# EasyEDA Pro project ECU_Project.epro, schematic Schematic1
Board Name: Embed Rev; Create Date: 2025-01-14; Page Name: P1; Project Name: ECU; Schematic Name: Schematic1; Update Date: 2025-02-04; Company: ProjectKita; Drawn: Yunus; Page Size: A2; Part Number: JLCPCB-002; Reviewed: EasyEDA; Version: V0.1
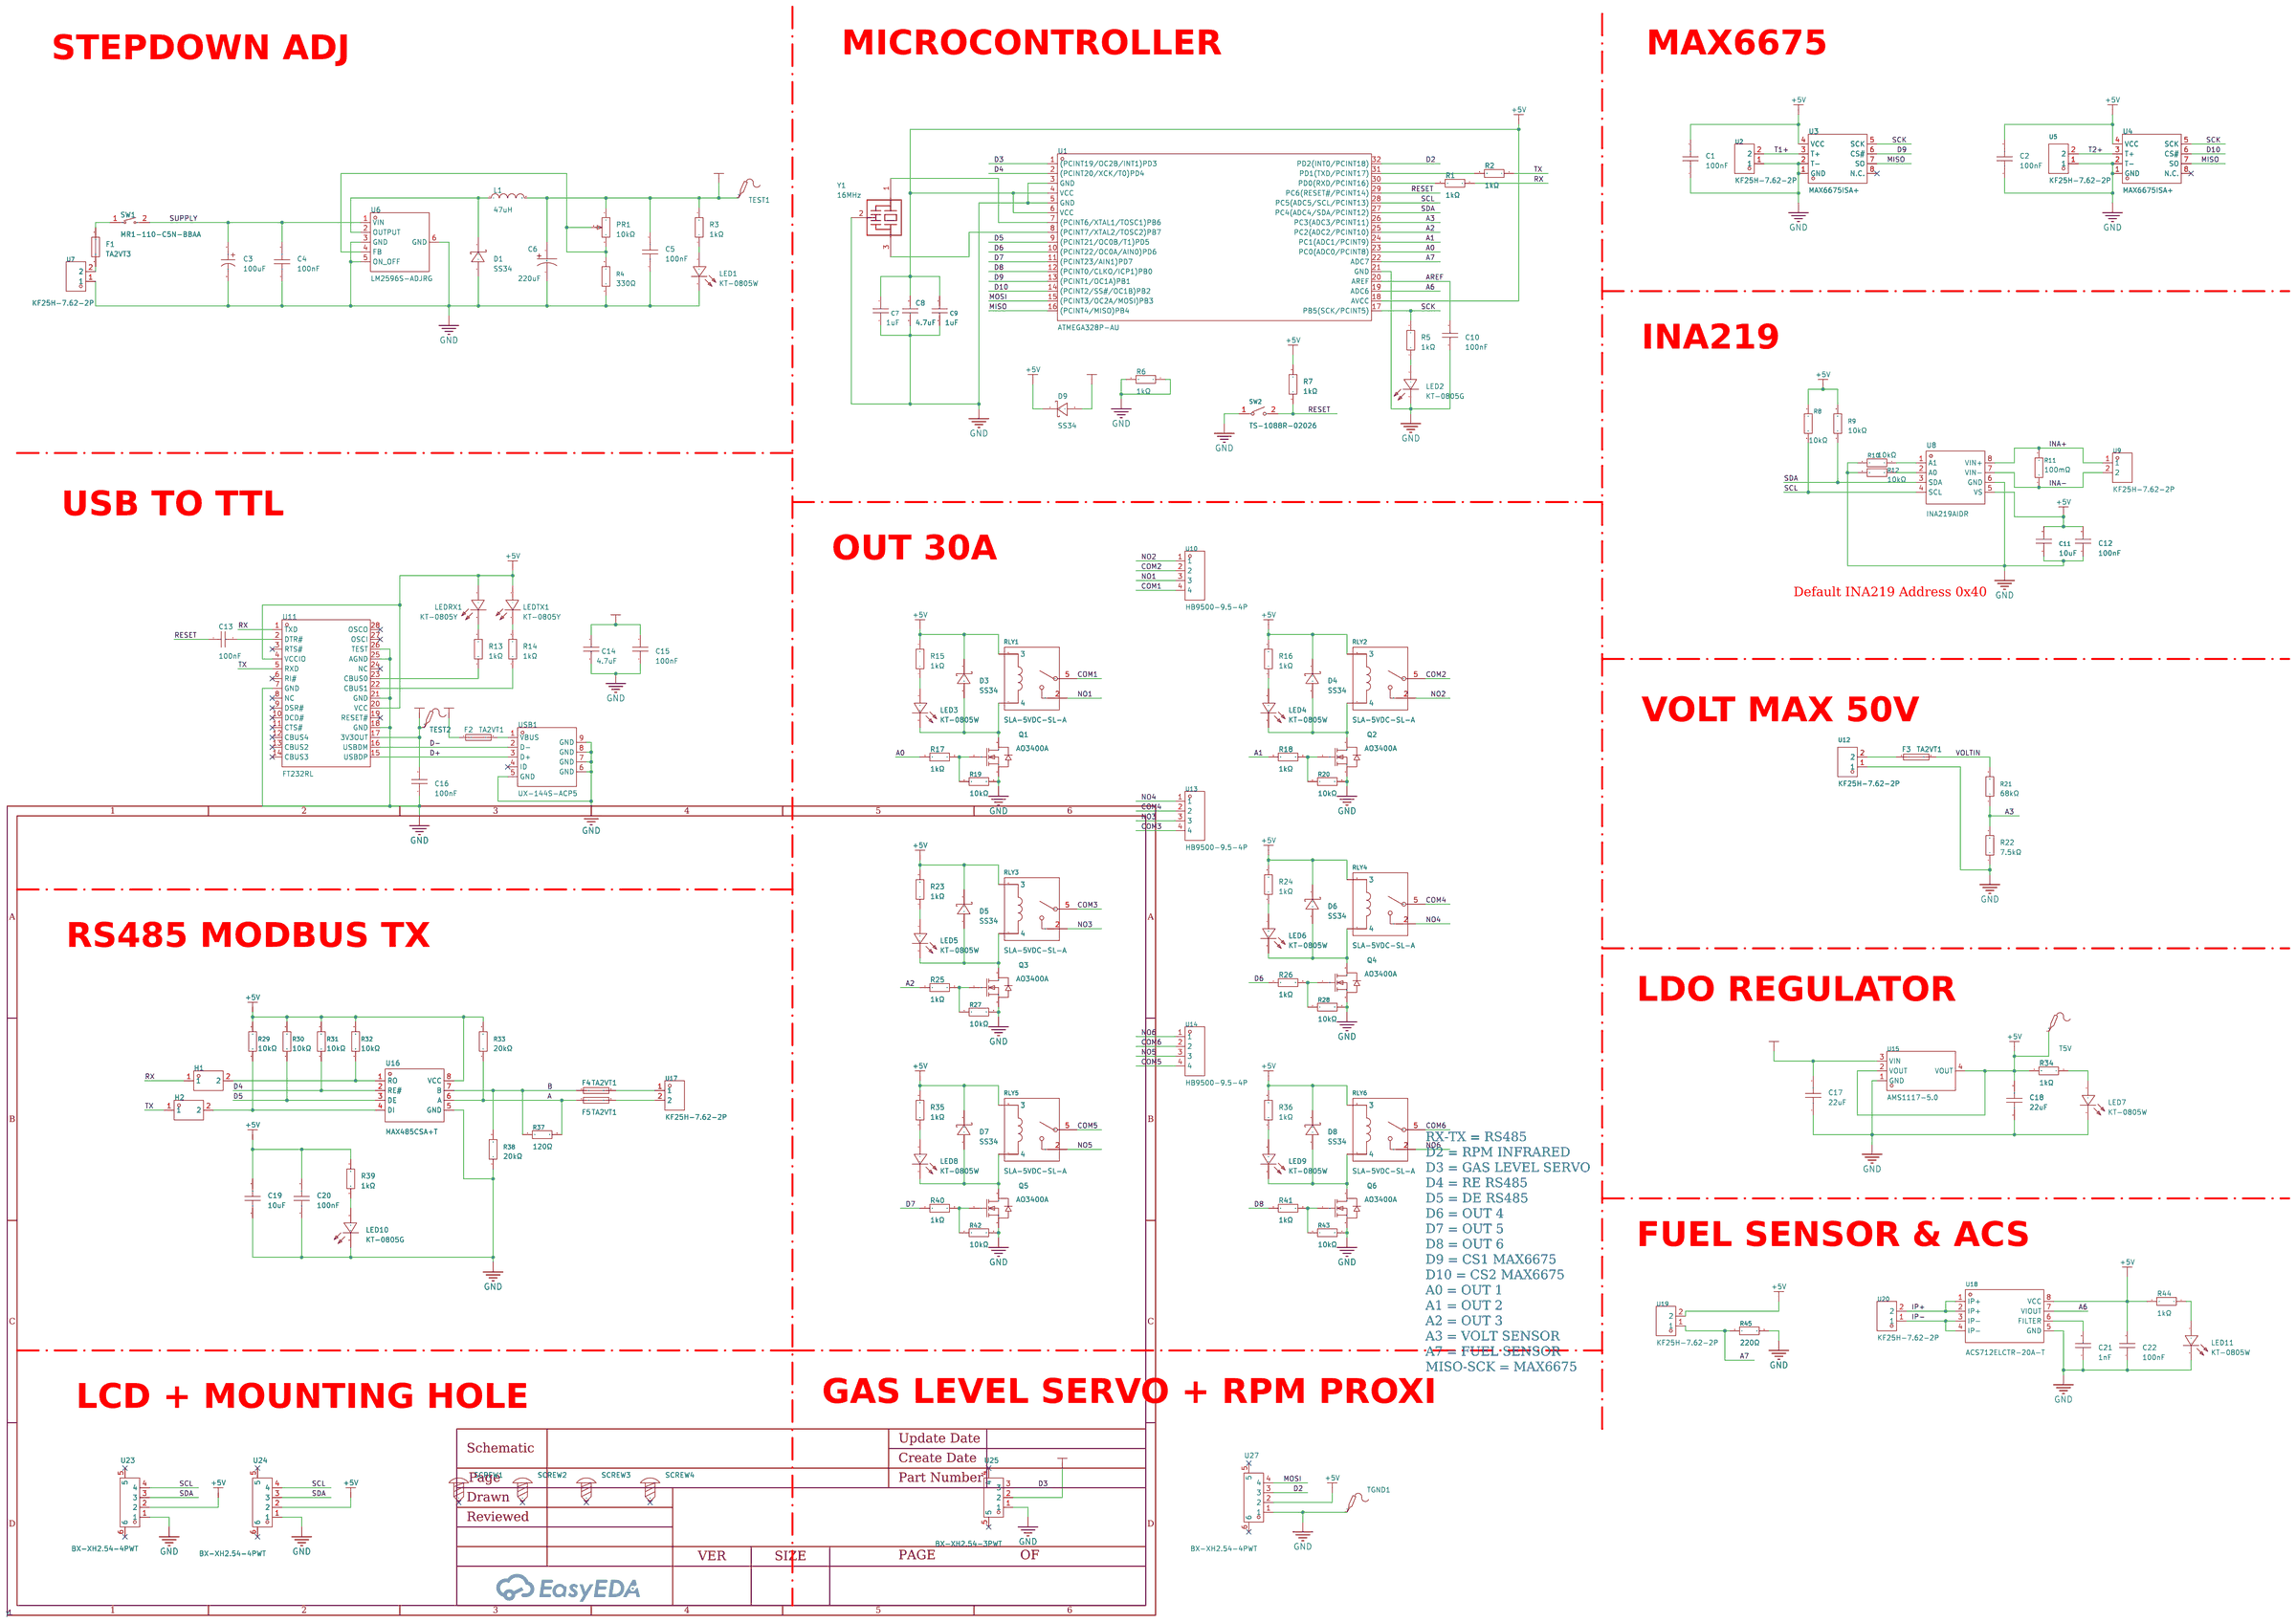
[diagram p1: schematic sheet]

## Parts
C1  100nF  [C0805]
C2  100nF  [C0805]
C3  100uF  [CAP-SMD_BD8.0-L8.3-W8.3-LS10.0-FD]
C4  100nF  [C0805]
C5  100nF  [C0805]
C6  220uF  [CAP-SMD_BD8.0-L8.3-W8.3-FD]
C7  1uF  [C0805]
C8  4.7uF  [C0805]
C9  1uF  [C0805]
C10  100nF  [C0805]
C11  10uF  [C0805]
C12  100nF  [C0805]
C13  100nF  [C0805]
C14  4.7uF  [C0805]
C15  100nF  [C0805]
C16  100nF  [C0805]
C17  22uF  [C0805]
C18  22uF  [C0805]
C19  10uF  [C0805]
C20  100nF  [C0805]
C21  1nF  [C0805]
C22  100nF  [C0805]
D1  SS34  [SMA_L4.3-W2.6-LS5.2-RD]
D3  SS34  [SMA_L4.3-W2.6-LS5.2-RD]
D4  SS34  [SMA_L4.3-W2.6-LS5.2-RD]
D5  SS34  [SMA_L4.3-W2.6-LS5.2-RD]
D6  SS34  [SMA_L4.3-W2.6-LS5.2-RD]
D7  SS34  [SMA_L4.3-W2.6-LS5.2-RD]
D8  SS34  [SMA_L4.3-W2.6-LS5.2-RD]
D9  SS34  [SMA_L4.3-W2.6-LS5.2-RD]
F1  TA2VT3  [FUSE-SMD_L6.1-W2.5]
F2  TA2VT1  [F2410]
F3  TA2VT1  [F2410]
F4  TA2VT1  [F2410]
F5  TA2VT1  [F2410]
H1  -  [HDR-TH_2P-P2.54-V-M-2]
H2  -  [HDR-TH_2P-P2.54-V-M-2]
L1  47uH  [IND-SMD_L12.0-W12.0_CDRH127NP]
LED1  KT-0805W  [LED0805-R-RD]
LED2  KT-0805G  [LED0805-R-RD]
LED3  KT-0805W  [LED0805-R-RD]
LED4  KT-0805W  [LED0805-R-RD]
LED5  KT-0805W  [LED0805-R-RD]
LED6  KT-0805W  [LED0805-R-RD]
LED7  KT-0805W  [LED0805-R-RD]
LED8  KT-0805W  [LED0805-R-RD]
LED9  KT-0805W  [LED0805-R-RD]
LED10  KT-0805G  [LED0805-R-RD]
LED11  KT-0805W  [LED0805-R-RD]
LEDRX1  KT-0805Y  [LED0805-R-RD]
LEDTX1  KT-0805Y  [LED0805-R-RD]
PR1  10kΩ  [RES-ADJ-TH_3P-L10.0-W10.0-P2.50-L]
Q1  AO3400A  [SOT-23-3_L2.9-W1.3-P1.90-LS2.4-BR]
Q2  AO3400A  [SOT-23-3_L2.9-W1.3-P1.90-LS2.4-BR]
Q3  AO3400A  [SOT-23-3_L2.9-W1.3-P1.90-LS2.4-BR]
Q4  AO3400A  [SOT-23-3_L2.9-W1.3-P1.90-LS2.4-BR]
Q5  AO3400A  [SOT-23-3_L2.9-W1.3-P1.90-LS2.4-BR]
Q6  AO3400A  [SOT-23-3_L2.9-W1.3-P1.90-LS2.4-BR]
R1  1kΩ  [R0805]
R2  1kΩ  [R0805]
R3  1kΩ  [R0805]
R4  330Ω  [R0805]
R5  1kΩ  [R0805]
R6  1kΩ  [R0805]
R7  1kΩ  [R0805]
R8  10kΩ  [R0805]
R9  10kΩ  [R0805]
R10  10kΩ  [R0805]
R11  100mΩ  [R1206]
R12  10kΩ  [R0805]
R13  1kΩ  [R0805]
R14  1kΩ  [R0805]
R15  1kΩ  [R0805]
R16  1kΩ  [R0805]
R17  1kΩ  [R0805]
R18  1kΩ  [R0805]
R19  10kΩ  [R0805]
R20  10kΩ  [R0805]
R21  68kΩ  [R0805]
R22  7.5kΩ  [R0805]
R23  1kΩ  [R0805]
R24  1kΩ  [R0805]
R25  1kΩ  [R0805]
R26  1kΩ  [R0805]
R27  10kΩ  [R0805]
R28  10kΩ  [R0805]
R29  10kΩ  [R0805]
R30  10kΩ  [R0805]
R31  10kΩ  [R0805]
R32  10kΩ  [R0805]
R33  20kΩ  [R0805]
R34  1kΩ  [R0805]
R35  1kΩ  [R0805]
R36  1kΩ  [R0805]
R37  120Ω  [R0805]
R38  20kΩ  [R0805]
R39  1kΩ  [R0805]
R40  1kΩ  [R0805]
R41  1kΩ  [R0805]
R42  10kΩ  [R0805]
R43  10kΩ  [R0805]
R44  1kΩ  [R0805]
R45  220Ω  [R0805]
RLY1  SLA-5VDC-SL-A  [RELAY-TH_SLA-XXVDC-SL-A]
RLY2  SLA-5VDC-SL-A  [RELAY-TH_SLA-XXVDC-SL-A]
RLY3  SLA-5VDC-SL-A  [RELAY-TH_SLA-XXVDC-SL-A]
RLY4  SLA-5VDC-SL-A  [RELAY-TH_SLA-XXVDC-SL-A]
RLY5  SLA-5VDC-SL-A  [RELAY-TH_SLA-XXVDC-SL-A]
RLY6  SLA-5VDC-SL-A  [RELAY-TH_SLA-XXVDC-SL-A]
SCREW1  -  [Screw-Hole-M4]
SCREW2  -  [Screw-Hole-M4]
SCREW3  -  [Screw-Hole-M4]
SCREW4  -  [Screw-Hole-M4]
SW1  MR1-110-C5N-BBAA  [SW-TH_MR1-110-C5N-BBAA]
SW2  TS-1088R-02026  [SW-SMD_L3.9-W3.0-P4.45]
T5V  -  [Test-Point-0.5mm]
TEST1  -  [Test-Point-0.5mm]
TEST2  -  [Test-Point-0.5mm]
TGND1  -  [Test-Point-0.5mm]
U1  ATMEGA328P-AU  [TQFP-32_L7.0-W7.0-P0.80-LS9.0-BL]
U2  KF25H-7.62-2P  [CONN-TH_KF25H-7.62-2P]
U3  MAX6675ISA+  [SOIC-8_L5.0-W4.0-P1.27-LS6.0-BL]
U4  MAX6675ISA+  [SOIC-8_L5.0-W4.0-P1.27-LS6.0-BL]
U5  KF25H-7.62-2P  [CONN-TH_KF25H-7.62-2P]
U6  LM2596S-ADJRG  [TO-263-5_L10.2-W8.6-P1.70-LS14.4-TL]
U7  KF25H-7.62-2P  [CONN-TH_KF25H-7.62-2P]
U8  INA219AIDR  [SOIC-8_L4.9-W3.9-P1.27-LS6.0-BL]
U9  KF25H-7.62-2P  [CONN-TH_KF25H-7.62-2P]
U10  HB9500-9.5-4P  [CONN-TH_HB9500-9.5-4P]
U11  FT232RL  [SSOP-28_L10.2-W5.3-P0.65-LS7.8-BL]
U12  KF25H-7.62-2P  [CONN-TH_KF25H-7.62-2P]
U13  HB9500-9.5-4P  [CONN-TH_HB9500-9.5-4P]
U14  HB9500-9.5-4P  [CONN-TH_HB9500-9.5-4P]
U15  AMS1117-5.0  [SOT-223_L6.5-W3.5-P2.30-LS7.0-BR]
U16  MAX485CSA+T  [SOIC-8_L4.9-W3.9-P1.27-LS6.0-BL]
U17  KF25H-7.62-2P  [CONN-TH_KF25H-7.62-2P]
U18  ACS712ELCTR-20A-T  [SOIC-8_L4.9-W3.9-P1.27-LS6.0-BL]
U19  KF25H-7.62-2P  [CONN-TH_KF25H-7.62-2P]
U20  KF25H-7.62-2P  [CONN-TH_KF25H-7.62-2P]
U23  BX-XH2.54-4PWT  [CONN-SMD_4P-P2.50_BX-XH2.54-4PWT]
U24  BX-XH2.54-4PWT  [CONN-SMD_4P-P2.50_BX-XH2.54-4PWT]
U25  BX-XH2.54-3PWT  [CONN-SMD_3P-P2.50_BX-XH2.54-3PWT]
U27  BX-XH2.54-4PWT  [CONN-SMD_4P-P2.50_BX-XH2.54-4PWT]
USB1  UX-144S-ACP5  [MINI-USB-SMD_UX-144S-ACP5]
Y1  16MHz  [OSC-SMD_3P-L3.2-W1.3-P1.2-L]

## Library data of the parts
C1 C2 = CC0805KRX7R9BB104: Capacitance: Tolerance:±10% Tolerance:±10% Voltage Rated: Temperature Coefficient:; LCSC Part Name: 100nF ±10% 50V; Supplier Part: C49678; Manufacturer: YAGEO(国巨); Supplier Footprint: 0805; Datasheet: https://atta.szlcsc.com/upload/public/pdf/source/20180224/C181747_15194369449651363981.pdf; Supplier: LCSC; Tolerance: ±10%
C3 = VT107M050FA5RR0NB1VP0: Capacitance:100uF Tolerance:±20% Tolerance:±20% Voltage Rated: Lifetime @ Temp:1000hrs@105℃ Operating Temperature:-55℃~+105℃ Operating Temperature:-55℃~+105℃; LCSC Part Name: 100uF ±20% 50V; Supplier Part: C3039790; Manufacturer: CX(承兴); Supplier Footprint: SMD,D8xL10.5mm; JLCPCB Part Class: Extended Part; Datasheet: https://atta.szlcsc.com/upload/public/pdf/source/20220628/103B6F721E7253D8C351AC0BCC0BACC0.pdf; Supplier: LCSC; Tolerance: ±20%; Lifetime @ Temp: 1000hrs@105℃; Operating Temperature: -55℃~+105℃
C4 C5 = C0805X104K5RAC7210: Capacitance: Tolerance:±10% Tolerance:±10% Voltage Rated: Temperature Coefficient:; LCSC Part Name: 100nF ±10% 50V; Supplier Part: C1864747; Manufacturer: KEMET(基美); Supplier Footprint: 0805; JLCPCB Part Class: Extended Part; Datasheet: https://atta.szlcsc.com/upload/public/pdf/source/20210401/3EFD8A2EC703B271DBCBA89912FC6ADE.pdf; Supplier: LCSC; Tolerance: ±10%
C6 = VT1V221M0810: Capacitance: Tolerance:±20% Tolerance:±20% Rated Voltage: Ripple Current:195mA@120Hz Equivalent Series Resistance(ESR):- φD: L: Lifetime @ Temp:2000hrs@105℃ Operating Temperature:-40℃~+105℃ Operating Temperature:-40℃~+105℃; LCSC Part Name: 220uF ±20% 35V; Supplier Part: C310848; Manufacturer: ROQANG(容强); Supplier Footprint: SMD,D8xL10.2mm; Datasheet: https://atta.szlcsc.com/upload/public/pdf/source/20181008/C311227_AA7DD9E3FABC2258A2485301C5CDF4D0.pdf; Supplier: LCSC; Tolerance: ±20%; Ripple Current: 195mA@120Hz; Lifetime @ Temp: 2000hrs@105℃; Operating Temperature: -40℃~+105℃
C7 C9 = CL21B105KBFNNNE: Capacitance: Tolerance:±10% Tolerance:±10% Voltage Rated: Temperature Coefficient:; LCSC Part Name: 1uF ±10% 50V; Supplier Part: C28323; Manufacturer: SAMSUNG(三星); Supplier Footprint: 0805; JLCPCB Part Class: Basic Part; Datasheet: https://atta.szlcsc.com/upload/public/pdf/source/20160218/1457707763339.pdf; Supplier: LCSC; Tolerance: ±10%
C8 C14 = CL21B475KOFNNNE: Capacitance: Tolerance:±10% Tolerance:±10% Voltage Rated: Temperature Coefficient:; LCSC Part Name: 4.7uF ±10% 16V; Supplier Part: C107365; Manufacturer: SAMSUNG(三星); Supplier Footprint: 0805; JLCPCB Part Class: Extended Part; Datasheet: https://atta.szlcsc.com/upload/public/pdf/source/20160218/1457707763339.pdf; Supplier: LCSC; Tolerance: ±10%
C10 C12 C13 C15 C16 C22 = CL21B104KCFNNNE: Capacitance: Tolerance:±10% Tolerance:±10% Voltage Rated: Temperature Coefficient:; LCSC Part Name: 100nF ±10% 100V; Supplier Part: C28233; Manufacturer: SAMSUNG(三星); Supplier Footprint: 0805; JLCPCB Part Class: Basic Part; Datasheet: https://atta.szlcsc.com/upload/public/pdf/source/20160218/1457707763339.pdf; Supplier: LCSC; Tolerance: ±10%
C11 = CL21A106KPFNNNE: Capacitance: Tolerance:±10% Tolerance:±10% Voltage Rated: Temperature Coefficient:; LCSC Part Name: 10uF ±10% 10V; Supplier Part: C17024; Manufacturer: SAMSUNG(三星); Supplier Footprint: 0805; Datasheet: https://atta.szlcsc.com/upload/public/pdf/source/20160218/1457707763339.pdf; Supplier: LCSC; Tolerance: ±10%
C17 C18 = CL21A226MAQNNNE: Capacitance: Tolerance:±20% Tolerance:±20% Voltage Rated: Temperature Coefficient:; LCSC Part Name: 22uF ±20% 25V; Supplier Part: C45783; Manufacturer: SAMSUNG(三星); Supplier Footprint: 0805; JLCPCB Part Class: Basic Part; Datasheet: https://atta.szlcsc.com/upload/public/pdf/source/20160218/1457707763339.pdf; Supplier: LCSC; Tolerance: ±20%
C19 = CL21A106KAYNNNE_C15850: Capacitance: Tolerance:±10% Tolerance:±10% Voltage Rated: Temperature Coefficient:; LCSC Part Name: 10uF ±10% 25V; Supplier Part: C15850; Manufacturer: SAMSUNG(三星); Manufacturer Part: CL21A106KAYNNNE; Supplier Footprint: 0805; JLCPCB Part Class: Basic Part; Datasheet: https://atta.szlcsc.com/upload/public/pdf/source/20160218/1457707763339.pdf; Supplier: LCSC; Tolerance: ±10%
C20 = CC0805KRX7R9BB104: Capacitance: Tolerance:±10% Tolerance:±10% Voltage Rated: Temperature Coefficient:; LCSC Part Name: 100nF ±10% 50V; Supplier Part: C49678; Manufacturer: YAGEO(国巨); Supplier Footprint: 0805; JLCPCB Part Class: Basic Part; Datasheet: https://atta.szlcsc.com/upload/public/pdf/source/20180224/C181747_15194369449651363981.pdf; Supplier: LCSC; Tolerance: ±10%
C21 = CL21B102KBCNNNC: Capacitance: Tolerance:±10% Tolerance:±10% Voltage Rated: Temperature Coefficient:; LCSC Part Name: 1nF ±10% 50V; Supplier Part: C46653; Manufacturer: SAMSUNG(三星); Supplier Footprint: 0805; Datasheet: https://atta.szlcsc.com/upload/public/pdf/source/20160218/1457707763339.pdf; Supplier: LCSC; Tolerance: ±10%
D1 D3-D9 = SS34_C8678: Diode Configuration:Independent Type Forward Voltage (Vf@If):550mV@3A Reverse Voltage (Vr):40V Rectified Current:3A Reverse Leakage Current (Ir):500uA@40V; LCSC Part Name: 电压:40V 电流:3A; Supplier Part: C8678; Manufacturer: MDD(辰达半导体); Supplier Footprint: SMA(DO-214AC); JLCPCB Part Class: Basic Part; Datasheet: https://atta.szlcsc.com/upload/public/pdf/source/20240710/2118BB86FDDB2E0B294389AC1F3F65C8.pdf; Supplier: LCSC; Diode Configuration: Independent Type; Forward Voltage (Vf@If): 550mV@3A; Reverse Voltage (Vr): 40V; Rectified Current: 3A; Reverse Leakage Current (Ir): 500uA@40V
F1 = TA2VT3: Type:SMD Fuse Current Rating:3A Voltage Rating  (AC):250V; LCSC Part Name: 2410 慢断 3A 250V 镀金; Supplier Part: C3014121; Manufacturer: TLC(竞沃); Supplier Footprint: 2410; JLCPCB Part Class: Extended Part; Datasheet: https://atta.szlcsc.com/upload/public/pdf/source/20220520/442597D85C5DD0BE46CC46EDD38271F0.pdf; Supplier: LCSC; Type: SMD Fuse; Current Rating: 3A; Voltage Rating  (AC): 250V
F2-F5 = TA2VT1: LCSC Part Name: 2410 慢断 1A 250V 镀金; Supplier Part: C3014117; Manufacturer: TLC(竞沃); Supplier Footprint: 2410; JLCPCB Part Class: Extended Part; Datasheet: https://atta.szlcsc.com/upload/public/pdf/source/20220520/442597D85C5DD0BE46CC46EDD38271F0.pdf; Supplier: LCSC
H1 H2 = HDR-M_2.54_2x1: Supplier Footprint: Through
L1 = CDRH127NP-470MC: Inductance: Tolerance:±20% Tolerance:±20% Rated Current: DC Resistance (DCR):; LCSC Part Name: 47uH ±20%; Supplier Part: C167265; Manufacturer: Sumida(胜美达); Supplier Footprint: SMD,12x12mm; Datasheet: https://atta.szlcsc.com/upload/public/pdf/source/20181128/C338772_674F45659D63C3CCC09EDB72BE7FF8CA.pdf; Supplier: LCSC; Tolerance: ±20%
LED1 LED3-LED9 LED11 = KT-0805W: LCSC Part Name: 0805 白灯 高亮; Supplier Part: C34499; Manufacturer: KENTO; Supplier Footprint: 0805; JLCPCB Part Class: Basic Part; Datasheet: https://atta.szlcsc.com/upload/public/pdf/source/20221124/DAA20402FFC1FB071B8B6797757426FE.pdf; Supplier: LCSC
LED2 LED10 = KT-0805G: Lamp Holder Type:- Emitted Color:Emerald Forward Voltage (VF):- Forward Voltage (VF):- Power Dissipation:- Forward Current:- Dominant Wavelength:- Dominant Wavelength:- Peak Wavelength:- Diode Configuration:- Lens Color:- Color Temperature:- Color Tempera; LCSC Part Name: 0805 翠绿 高亮; Supplier Part: C2297; Manufacturer: KENTO; Supplier Footprint: 0805; JLCPCB Part Class: Basic Part; Datasheet: https://atta.szlcsc.com/upload/public/pdf/source/20170209/1486607340485.pdf; Supplier: LCSC; Emitted Color: Emerald
LEDRX1 LEDTX1 = KT-0805Y: Emitted Color:Yellow Power Dissipation:- Forward Current:- Dominant Wavelength:- Dominant Wavelength:- Peak Wavelength:- Diode Configuration:- Lens Color:- Color Temperature:- Color Temperature:- Viewing Angle:- Mounting Sytle:- Operating Temperature:- Op; LCSC Part Name: 0805 黄灯 高亮; Supplier Part: C2296; Manufacturer: KENTO; Supplier Footprint: 0805; JLCPCB Part Class: Basic Part; Datasheet: https://atta.szlcsc.com/upload/public/pdf/source/20160421/1461205044170.pdf; Supplier: LCSC; Emitted Color: Yellow
PR1 = R_3296: Supplier Footprint: Through
Q1-Q6 = AO3400A_C20917: Type:1 N-Channel Drain Source Voltage (Vdss): Continuous Drain Current (Id): Drain Source On Resistance (RDS(on)@Vgs,Id):26.5mΩ@10V,5.7A Power Dissipation (Pd): Gate Threshold Voltage (Vgs(th)@Id):1.5V@250uA Total Gate Charge (Qg@Vgs):7nC@4.5V Input Capac; LCSC Part Name: 1个N沟道 耐压:30V 电流:5.7A; Supplier Part: C20917; Manufacturer: AOS; Supplier Footprint: SOT-23-3L; JLCPCB Part Class: Basic Part; Datasheet: https://atta.szlcsc.com/upload/public/pdf/source/20140107/1457706668533.pdf; Supplier: LCSC; Type: 1 N-Channel; Drain Source On Resistance (RDS(on)@Vgs,Id): 26.5mΩ@10V,5.7A; Gate Threshold Voltage (Vgs(th)@Id): 1.5V@250uA; Total Gate Charge (Qg@Vgs): 7nC@4.5V; Input Capacitance (Ciss@Vds): 630pF@15V; Operating Temperature: -55℃~+150℃@(Tj)
R1-R3 R5-R7 R13-R18 R23-R26 R34-R36 R39-R41 R44 = 0805W8F1001T5E: Type:Thick Film Resistors Resistance:1kΩ Tolerance:±1% Tolerance:±1% Power(Watts): Overload Voltage (Max): Temperature Coefficient:±100ppm/℃ Temperature Coefficient:±100ppm/℃ Operating Temperature Range:-55℃~+155℃ Operating Temperature Range:-55℃~+155℃; LCSC Part Name: 1kΩ ±1% 125mW 厚膜电阻; Supplier Part: C17513; Manufacturer: UNI-ROYAL(厚声); Supplier Footprint: 0805; JLCPCB Part Class: Basic Part; Datasheet: https://atta.szlcsc.com/upload/public/pdf/source/20200306/C422600_1E6D84923E4A46A82E41ADD87F860B5C.pdf; Supplier: LCSC; Type: Thick Film Resistors; Tolerance: ±1%; Temperature Coefficient: ±100ppm/℃; Operating Temperature Range: -55℃~+155℃
R4 = 0805W8F3300T5E: Type:Thick Film Resistors Resistance: Tolerance:±1% Tolerance:±1% Power(Watts): Overload Voltage (Max): Temperature Coefficient:±100ppm/℃ Temperature Coefficient:±100ppm/℃ Operating Temperature Range:-55℃~+155℃ Operating Temperature Range:-55℃~+155℃; LCSC Part Name: 330Ω ±1% 125mW 厚膜电阻; Supplier Part: C17630; Manufacturer: UNI-ROYAL(厚声); Supplier Footprint: 0805; Datasheet: https://atta.szlcsc.com/upload/public/pdf/source/20200306/C422600_1E6D84923E4A46A82E41ADD87F860B5C.pdf; Supplier: LCSC; Type: Thick Film Resistors; Tolerance: ±1%; Temperature Coefficient: ±100ppm/℃; Operating Temperature Range: -55℃~+155℃
R8-R10 R12 R19 R20 R27-R32 R42 R43 = 0805W8F1002T5E: Type:Thick Film Resistors Resistance:10kΩ Tolerance:±1% Tolerance:±1% Power(Watts): Overload Voltage (Max): Temperature Coefficient:±100ppm/℃ Temperature Coefficient:±100ppm/℃ Operating Temperature Range:-55℃~+155℃ Operating Temperature Range:-55℃~+155℃; LCSC Part Name: 10kΩ ±1% 125mW 厚膜电阻; Supplier Part: C17414; Manufacturer: UNI-ROYAL(厚声); Supplier Footprint: 0805; JLCPCB Part Class: Basic Part; Datasheet: https://atta.szlcsc.com/upload/public/pdf/source/20200306/C422600_1E6D84923E4A46A82E41ADD87F860B5C.pdf; Supplier: LCSC; Type: Thick Film Resistors; Tolerance: ±1%; Temperature Coefficient: ±100ppm/℃; Operating Temperature Range: -55℃~+155℃
R11 = 1206W4F100LT5E: Type:Thick Film Resistors Resistance:100mΩ Tolerance:±1% Tolerance:±1% Power(Watts): Overload Voltage (Max): Temperature Coefficient:±800ppm/℃ Temperature Coefficient:±800ppm/℃ Operating Temperature Range:-55℃~+155℃ Operating Temperature Range:-55℃~+155℃; LCSC Part Name: 100mΩ ±1% 250mW 厚膜电阻; Supplier Part: C25334; Manufacturer: UNI-ROYAL(厚声); Supplier Footprint: 1206; JLCPCB Part Class: Basic Part; Datasheet: https://atta.szlcsc.com/upload/public/pdf/source/20200306/C422600_1E6D84923E4A46A82E41ADD87F860B5C.pdf; Supplier: LCSC; Type: Thick Film Resistors; Tolerance: ±1%; Temperature Coefficient: ±800ppm/℃; Operating Temperature Range: -55℃~+155℃
R21 = 0805W8F6802T5E: Type:Thick Film Resistors Resistance:68kΩ Tolerance:±1% Tolerance:±1% Power(Watts): Overload Voltage (Max): Temperature Coefficient:±100ppm/℃ Temperature Coefficient:±100ppm/℃ Operating Temperature Range:-55℃~+155℃ Operating Temperature Range:-55℃~+155℃; LCSC Part Name: 68kΩ ±1% 125mW 厚膜电阻; Supplier Part: C17801; Manufacturer: UNI-ROYAL(厚声); Supplier Footprint: 0805; JLCPCB Part Class: Basic Part; Datasheet: https://atta.szlcsc.com/upload/public/pdf/source/20200306/C422600_1E6D84923E4A46A82E41ADD87F860B5C.pdf; Supplier: LCSC; Type: Thick Film Resistors; Tolerance: ±1%; Temperature Coefficient: ±100ppm/℃; Operating Temperature Range: -55℃~+155℃
R22 = 0805W8F7501T5E: Type:Thick Film Resistors Resistance:7.5kΩ Tolerance:±1% Tolerance:±1% Power(Watts): Overload Voltage (Max): Temperature Coefficient:±100ppm/℃ Temperature Coefficient:±100ppm/℃ Operating Temperature Range:-55℃~+155℃ Operating Temperature Range:-55℃~+155℃; LCSC Part Name: 7.5kΩ ±1% 125mW 厚膜电阻; Supplier Part: C17807; Manufacturer: UNI-ROYAL(厚声); Supplier Footprint: 0805; JLCPCB Part Class: Extended Part; Datasheet: https://atta.szlcsc.com/upload/public/pdf/source/20200306/C422600_1E6D84923E4A46A82E41ADD87F860B5C.pdf; Supplier: LCSC; Type: Thick Film Resistors; Tolerance: ±1%; Temperature Coefficient: ±100ppm/℃; Operating Temperature Range: -55℃~+155℃
R33 R38 = 0805W8F2002T5E: Type:Thick Film Resistors Resistance:20kΩ Tolerance:±1% Tolerance:±1% Power(Watts): Overload Voltage (Max): Temperature Coefficient:±100ppm/℃ Temperature Coefficient:±100ppm/℃ Operating Temperature Range:-55℃~+155℃ Operating Temperature Range:-55℃~+155℃; LCSC Part Name: 20kΩ ±1% 125mW 厚膜电阻; Supplier Part: C4328; Manufacturer: UNI-ROYAL(厚声); Supplier Footprint: 0805; JLCPCB Part Class: Basic Part; Datasheet: https://atta.szlcsc.com/upload/public/pdf/source/20200306/C422600_1E6D84923E4A46A82E41ADD87F860B5C.pdf; Supplier: LCSC; Type: Thick Film Resistors; Tolerance: ±1%; Temperature Coefficient: ±100ppm/℃; Operating Temperature Range: -55℃~+155℃
R37 = 0805W8F1200T5E: Type:Thick Film Resistors Resistance: Tolerance:±1% Tolerance:±1% Power(Watts): Overload Voltage (Max): Temperature Coefficient:±100ppm/℃ Temperature Coefficient:±100ppm/℃ Operating Temperature Range:-55℃~+155℃ Operating Temperature Range:-55℃~+155℃; LCSC Part Name: 120Ω ±1% 125mW 厚膜电阻; Supplier Part: C17437; Manufacturer: UNI-ROYAL(厚声); Supplier Footprint: 0805; JLCPCB Part Class: Basic Part; Datasheet: https://atta.szlcsc.com/upload/public/pdf/source/20200306/C422600_1E6D84923E4A46A82E41ADD87F860B5C.pdf; Supplier: LCSC; Type: Thick Film Resistors; Tolerance: ±1%; Temperature Coefficient: ±100ppm/℃; Operating Temperature Range: -55℃~+155℃
R45 = 0805W8F2200T5E: Type:Thick Film Resistors Resistance: Tolerance:±1% Tolerance:±1% Power(Watts): Overload Voltage (Max): Temperature Coefficient:±100ppm/℃ Temperature Coefficient:±100ppm/℃ Operating Temperature Range:-55℃~+155℃ Operating Temperature Range:-55℃~+155℃; LCSC Part Name: 220Ω ±1% 125mW 厚膜电阻; Supplier Part: C17557; Manufacturer: UNI-ROYAL(厚声); Supplier Footprint: 0805; JLCPCB Part Class: Basic Part; Datasheet: https://atta.szlcsc.com/upload/public/pdf/source/20200306/C422600_1E6D84923E4A46A82E41ADD87F860B5C.pdf; Supplier: LCSC; Type: Thick Film Resistors; Tolerance: ±1%; Temperature Coefficient: ±100ppm/℃; Operating Temperature Range: -55℃~+155℃
RLY1-RLY6 = SLA-5VDC-SL-A_C87363: Coil Voltage:5V Contact Form:一组常开:1A(SPST-常开) Pin Number:4 Contact Rating:- Maximum Switching Voltage:250V@AC Coil Rated Power:900mW Maximum Switching Current:30A Coil Type:无极性-单线圈 Coil Resistance:27Ω Contact Resistance:100mΩ Operate Time:10ms Release Tim; LCSC Part Name: 蓝色; Supplier Part: C87363; Manufacturer: 松乐; Supplier Footprint: 插件,27.6x32mm; JLCPCB Part Class: Extended Part; Supplier: LCSC; Coil Voltage: 5V; Contact Form: 一组常开:1A(SPST-常开); Pin Number: 4; Maximum Switching Voltage: 250V@AC; Coil Rated Power: 900mW; Maximum Switching Current: 30A; Coil Type: 无极性-单线圈; Coil Resistance: 27Ω; Contact Resistance: 100mΩ; Operate Time: 10ms; Release Time: 10ms
SCREW1-SCREW4 = Screw-Hole-M4: Supplier Footprint: 插件
SW1 = MR1-110-C5N-BBAA: Switch Length:21mm Switch Width:15mm Switch Height:- Actuator Type:凹Sided弯曲 With Lamp:- Pin Style:Solder Lug Actuator Color:Black Contact Current:6A Voltage Rating (AC):250V Voltage Rating (DC):- Circuit:SPST Mechanical Life:- Operating Temperature:- Oper; LCSC Part Name: 21*15开关ON-OFF 6A 250VAC; Supplier Part: C268221; Manufacturer: HONGJU(宏聚); Supplier Footprint: 插件; Datasheet: https://atta.szlcsc.com/upload/public/pdf/source/20230419/1E8CB3AE79E1F0919FEEEA30CDFE80E6.pdf; Supplier: LCSC; Switch Length: 21mm; Switch Width: 15mm; Actuator Type: 凹Sided弯曲; Pin Style: Solder Lug; Actuator Color: Black; Contact Current: 6A; Voltage Rating (AC): 250V; Circuit: SPST; Actuator Identifier: - O
SW2 = TS-1088R-02026: Circuit:SPST Actuator Style:Round Button Mounting Style:Brick nogging Switch Length:3.9mm Switch Width:2.93mm Switch Height:2mm Contact Current:50mA Voltage Rating (DC):12V With Lamp:- Mechanical Life:-; LCSC Part Name: 3.9*2.93*2mm 立贴 轻触开关; Supplier Part: C455280; Manufacturer: XUNPU(讯普); Supplier Footprint: SMD,3x4mm; JLCPCB Part Class: Extended Part; Datasheet: https://atta.szlcsc.com/upload/public/pdf/source/20191118/C455281_EC5379764BC1462550DF64BBBFEA9579.pdf; Supplier: LCSC; Circuit: SPST; Actuator Style: Round Button; Mounting Style: Brick nogging; Switch Length: 3.9mm; Switch Width: 2.93mm; Switch Height: 2mm; Contact Current: 50mA; Voltage Rating (DC): 12V
T5V TEST1 TEST2 TGND1 = Test-Point: Test Point 测试点
U1 = ATMEGA328P-AU: Supplier Part: C2851158; Supplier Footprint: TQFP-32(7x7); JLCPCB Part Class: Extended Part; Supplier: LCSC
U2 U5 U7 U9 U12 U17 U19 U20 = KF25H-7.62-2P: Barrier Type:两面 Pitch:7.62mm Structure:1x2P Mounting Style:直针 Pin Location:中脚 Number of Pins:2P Number of Rows:1 Current Rating (Max):24A Voltage Rating (Max):250V Wire Gauge - AWG:12~22 Wire Gauge - mm2:2.5 Operating Temperature Range:-40℃~+105℃ Operatin; LCSC Part Name: 7.62mm 1x2P 每排P数:2 排数:1 直针 中脚; Supplier Part: C707373; Manufacturer: KEFA(科发); Supplier Footprint: 插件,P=7.62mm; JLCPCB Part Class: Extended Part; Datasheet: https://atta.szlcsc.com/upload/public/pdf/source/20230331/B8163085C79313A2C4A164167C1F6859.pdf; Supplier: LCSC; Barrier Type: 两面; Pitch: 7.62mm; Structure: 1x2P; Mounting Style: 直针; Pin Location: 中脚; Number of Pins: 2P; Number of Rows: 1; Current Rating (Max): 24A; Voltage Rating (Max): 250V; Wire Gauge - AWG: 12~22; Wire Gauge - mm2: 2.5; Operating Temperature Range: -40℃~+105℃; Color: Black; Number of PINs Per Row: 2
U3 U4 = MAX6675ISA+: Interface:SPI Supply Voltage:3V~5.5V Supply Voltage:3V~5.5V Operating Temperature:-20℃~+85℃ Operating Temperature:-20℃~+85℃; LCSC Part Name: 冷端补偿K型热电偶数字转换器 (0°C至+1024°C); Supplier Part: C17403562; Manufacturer: ADI(亚德诺)/MAXIM(美信); Supplier Footprint: SOIC-8; Supplier: LCSC; Interface: SPI; Supply Voltage: 3V~5.5V; Operating Temperature: -20℃~+85℃
U6 = LM2596S-ADJRG: Function:Step-down type Input Voltage:4.5V~40V Input Voltage:4.5V~40V Output Voltage:1.193V~1.267V Output Voltage:1.193V~1.267V Output Current (Max):3A Switching Frequency:150kHz Operating Temperature:-40℃~+125℃ Operating Temperature:-40℃~+125℃ Quiescent; Supplier Part: C2977091; Manufacturer: HGC(深圳汉芯); Supplier Footprint: TO-263-5; JLCPCB Part Class: Extended Part; Datasheet: https://atta.szlcsc.com/upload/public/pdf/source/20220328/865467124ADE3A2E602647F447527F37.pdf; Supplier: LCSC; Function: Step-down type; Input Voltage: 4.5V~40V; Output Voltage: 1.193V~1.267V; Output Current (Max): 3A; Switching Frequency: 150kHz; Operating Temperature: -40℃~+125℃; Quiescent Current (Iq): 10mA; Switch tube (built-in/external): 内置
U8 = INA219AIDR: LCSC Part Name: 零漂移双向电流/功率监测器带I2C接口; Supplier Part: C138706; Manufacturer: TI(德州仪器); Supplier Footprint: SOIC-8; Datasheet: https://www.ti.com/cn/lit/gpn/ina219; Supplier: LCSC
U10 U13 U14 = HB9500-9.5-4P: Barrier Type:三面 Pitch:9.5mm Structure:1x4P Mounting Style:直针 Pin Location:边脚 Number of Pins:4P Number of Rows:1 Current Rating (Max):32A Voltage Rating (Max):750V Wire Gauge - AWG:10~18 Wire Gauge - mm2:4 Operating Temperature Range:-40℃~+105℃ Operating T; LCSC Part Name: 9.5mm 1x4P 每排P数:4 排数:1 直针 边脚; Supplier Part: C707838; Manufacturer: KEFA(科发); Supplier Footprint: 插件,P=9.5mm; JLCPCB Part Class: Extended Part; Datasheet: https://atta.szlcsc.com/upload/public/pdf/source/20230331/5873E5542BF93058E17D8678A7A76DA1.pdf; Supplier: LCSC; Barrier Type: 三面; Pitch: 9.5mm; Structure: 1x4P; Mounting Style: 直针; Pin Location: 边脚; Number of Pins: 4P; Number of Rows: 1; Current Rating (Max): 32A; Voltage Rating (Max): 750V; Wire Gauge - AWG: 10~18; Wire Gauge - mm2: 4; Operating Temperature Range: -40℃~+105℃; Color: Black; Number of PINs Per Row: 4
U11 = FT232RL: Applications Function: Protocol:; Supplier Part: C490691; Manufacturer: FTDI(飞特帝亚); Supplier Footprint: SSOP-28-208mil; JLCPCB Part Class: Extended Part; Datasheet: https://atta.szlcsc.com/upload/public/pdf/source/20200318/C490691_690E4DF63E1AFF9F26AE376DE8985AE3.pdf; Supplier: LCSC
U15 = AMS1117-5.0_C6187: Output Type: Maximum Input Voltage:12V Output Voltage:5V Output Voltage:5V MAX Output Current:1A Power Supply Rejection Ratio (PSRR):68dB@(120Hz) Dropout Voltage:1.3V@(1A) standby current:- Noise:- Feature:- Operating Temperature:- Operating Temperature:-; LCSC Part Name: 输入12V 输出5V 1A; Supplier Part: C6187; Manufacturer: AMS; Supplier Footprint: SOT-223; JLCPCB Part Class: Basic Part; Datasheet: https://atta.szlcsc.com/upload/public/pdf/source/20230918/E4B716057EE82179D88E8A0894830D59.pdf; Supplier: LCSC; Maximum Input Voltage: 12V; Output Voltage: 5V; MAX Output Current: 1A; Power Supply Rejection Ratio (PSRR): 68dB@(120Hz); Dropout Voltage: 1.3V@(1A); Output Polarity: Positive electrode; Number of Outputs: 1
U16 = MAX485CSA+T: Types:Transceiver Number of Driver:1 Number of receiver:1 Supply Voltage:4.75V~5.25V Supply Voltage:4.75V~5.25V Data Rate:2.5Mbps Data Rate:2.5Mbps Operating Temperature:0℃~+70℃ Operating Temperature:0℃~+70℃; LCSC Part Name: 低功耗、限摆率、RS-485/RS-422收发器; Supplier Part: C9945; Manufacturer: ADI(亚德诺)/MAXIM(美信); Supplier Footprint: SOIC-8; Datasheet: https://atta.szlcsc.com/upload/public/pdf/source/20121117/1457706559654.pdf; Supplier: LCSC; Types: Transceiver; Number of Driver: 1; Number of receiver: 1; Supply Voltage: 4.75V~5.25V; Data Rate: 2.5Mbps; Operating Temperature: 0℃~+70℃
U18 = ACS712ELCTR-20A-T: Current Range:20A Current Range:20A Supply Voltage:5V Supply Voltage:5V Sensitivity:100mV/A Operating Temperature:-40℃~+85℃ Operating Temperature:-40℃~+85℃; Supplier Part: C10681; Manufacturer: ALLEGRO(美国埃戈罗); Supplier Footprint: SOIC-8; JLCPCB Part Class: Extended Part; Datasheet: https://atta.szlcsc.com/upload/public/pdf/source/20130706/1457706622210.pdf; Supplier: LCSC; Current Range: 20A; Supply Voltage: 5V; Sensitivity: 100mV/A; Operating Temperature: -40℃~+85℃
U23 U24 U27 = BX-XH2.54-4PWT: Pins Structure:1x4P Pitch:2.54mm Mounting Style:Horizontal attachment Reference Series:XH Number of Pins:4P Number of Rows:1 Number of PINs Per Row:4 Row Spacing:- Current Rating (Max):3A Contact Material:Brass Contact Plating:Tin Operating Temperature Ra; LCSC Part Name: 配套胶壳型号：BX-XH2.54-4PJK 配套端子型号：BX-XH2.54-DZ 配套杜邦线型号：BX-XH2.54-4PBXC; Supplier Part: C18077874; Manufacturer: Bossie(博锡); Supplier Footprint: SMD,P=2.54mm,卧贴; Datasheet: https://atta.szlcsc.com/upload/public/pdf/source/20231017/0190CFE07212E1CAC18B68BF0ACD8A1F.pdf; Supplier: LCSC; Pins Structure: 1x4P; Pitch: 2.54mm; Mounting Style: Horizontal attachment; Reference Series: XH; Number of Pins: 4P; Number of Rows: 1; Number of PINs Per Row: 4; Current Rating (Max): 3A; Contact Material: Brass; Contact Plating: Tin; Operating Temperature Range: -25℃~+85℃
U25 = BX-XH2.54-3PWT: Pins Structure:1x3P Pitch:2.54mm Mounting Style:Horizontal attachment Reference Series:XH Number of Pins:3P Number of Rows:1 Number of PINs Per Row:3 Row Spacing:- Current Rating (Max):3A Contact Material:Brass Contact Plating:Tin Operating Temperature Ra; Supplier Part: C18077873; Manufacturer: Bossie(博锡); Supplier Footprint: SMD,P=2.54mm,卧贴; JLCPCB Part Class: Extended Part; Datasheet: https://atta.szlcsc.com/upload/public/pdf/source/20231017/EDA27ED746708C958B6F1C9F7AF7FBE7.pdf; Supplier: LCSC; Pins Structure: 1x3P; Pitch: 2.54mm; Mounting Style: Horizontal attachment; Reference Series: XH; Number of Pins: 3P; Number of Rows: 1; Number of PINs Per Row: 3; Current Rating (Max): 3A; Contact Material: Brass; Contact Plating: Tin; Operating Temperature Range: -25℃~+85℃
USB1 = UX-144S-ACP5: Connector Type:Mini-B Standard:USB 2.0 Gender:Female Mounting Style:卧贴 Number of Contacts:5P Number of Ports:1 Current Rating - Power (Max):1.5A Operating Temperature Range:-20℃~+70℃ Operating Temperature Range:-20℃~+70℃ Soldering Temperature(Max):260℃; LCSC Part Name: Mini-B 母 卧贴; Supplier Part: C720611; Manufacturer: XUNPU(讯普); Supplier Footprint: SMD; JLCPCB Part Class: Extended Part; Datasheet: https://atta.szlcsc.com/upload/public/pdf/source/20200812/C720611_E8490E4C4B00597353DD684194E98629.pdf; Supplier: LCSC; Connector Type: Mini-B; Standard: USB 2.0; Gender: Female; Mounting Style: 卧贴; Number of Contacts: 5P; Number of Ports: 1; Current Rating - Power (Max): 1.5A; Operating Temperature Range: -20℃~+70℃; Soldering Temperature(Max): 260℃
Y1 = 16MHz: LCSC Part Name: 16MHz ±0.5% 内置负载电容:15pF; Supplier Part: C91585; Manufacturer: muRata(村田); Manufacturer Part: CSTCE16M0V53Z-R0; Supplier Footprint: SMD3213-3P; Datasheet: https://atta.szlcsc.com/upload/public/pdf/source/20161226/1482720170907.pdf; Supplier: LCSC; Operating Temperature: -40℃~+125℃; Check: true

## Nets
+3.3V: C16.2 TEST2.1 U11.17(3V3OUT)
+5V: C1.2 C2.2 C7.2 C8.2 C9.2 C11.2 C12.2 C18.2 C19.2 C20.2 C22.2 D3.1(K) D4.1(K) D5.1(K) D6.1(K) D7.1(K) D8.1(K) D9.1(K) LEDRX1.1(+) LEDTX1.1(+) R7.2 R8.1 R9.2 R15.2 R16.2 R23.2 R24.2 R29.2 R30.2 R31.2 R32.2 R33.2 R34.2 R35.2 R36.2 R39.2 R44.2 RLY1.3 RLY2.3 RLY3.3 RLY4.3 RLY5.3 RLY6.3 T5V.1 U1.4(VCC) U1.6(VCC) U1.18(AVCC) U3.4(VCC) U4.4(VCC) U8.5(VS) U11.4(VCCIO) U11.20(VCC) U15.2(VOUT) U15.4(VOUT) U16.8(VCC) U18.8(VCC) U19.2 U23.2 U24.2 U27.2
GND: C1.1 C2.1 C3.2 C4.1 C5.1 C6.2 C7.1 C8.1 C9.1 C10.1 C11.1 C12.1 C14.1 C15.1 C16.1 C17.1 C18.1 C19.1 C20.1 C21.1 C22.1 D1.2(A) LED1.2(K) LED2.2(K) LED7.2(K) LED10.2(K) LED11.2(K) Q1.2(S) Q2.2(S) Q3.2(S) Q4.2(S) Q5.2(S) Q6.2(S) R4.1 R6.1 R6.2 R10.2 R12.2 R19.2 R20.2 R22.1 R27.2 R28.2 R38.1 R42.2 R43.2 R45.2 SW2.1 TGND1.1 U1.3(GND) U1.5(GND) U1.21(GND) U2.1 U3.1(GND) U3.2(T-) U4.1(GND) U4.2(T-) U5.1 U6.3(GND) U6.5(ON_OFF) U6.6(GND) U7.1 U8.6(GND) U11.7(GND) U11.18(GND) U11.21(GND) U11.25(AGND) U11.26(TEST) U12.1 U15.1(GND) U16.5(GND) U18.5(GND) U23.1 U24.1 U25.1 U27.1 USB1.5(GND) USB1.6(GND) USB1.7(GND) USB1.8(GND) USB1.9(GND) Y1.2(VSS)
+ADJV: C5.2 C6.1 C17.2 L1.2 PR1.1 R3.2 TEST1.1 U15.3(VIN) U25.2
A: F5.1 R33.1 R37.2 U16.6(A)
A0: R17.1 U1.23(PC0(ADC0/PCINT8))
A1: R18.1 U1.24(PC1(ADC1/PCINT9))
A2: R25.1 U1.25(PC2(ADC2/PCINT10))
A3: R21.1 R22.2 U1.26(PC3(ADC3/PCINT11))
A6: U1.19(ADC6) U18.7(VIOUT)
A7: R45.1 U1.22(ADC7) U19.1
AREF: C10.2 U1.20(AREF)
B: F4.1 R37.1 R38.2 U16.7(B)
COM1: RLY1.5 U10.4
COM2: RLY2.5 U10.2
COM3: RLY3.5 U13.4
COM4: RLY4.5 U13.2
COM5: RLY5.5 U14.4
COM6: RLY6.5 U14.2
D2: U1.32(PD2(INT0/PCINT18)) U27.3
D3: U1.1((PCINT19/OC2B/INT1)PD3) U25.3
D4: R31.1 U1.2((PCINT20/XCK/T0)PD4) U16.2(RE#)
D5: R30.1 U1.9((PCINT21/OC0B/T1)PD5) U16.3(DE)
D6: R26.1 U1.10((PCINT22/OC0A/AIN0)PD6)
D7: R40.1 U1.11((PCINT23/AIN1)PD7)
D8: R41.1 U1.12((PCINT0/CLKO/ICP1)PB0)
D9: U1.13((PCINT1/OC1A)PB1) U3.6(CS#)
D10: U1.14((PCINT2/SS#/OC1B)PB2) U4.6(CS#)
D+: U11.15(USBDP) USB1.3(D+)
D-: U11.16(USBDM) USB1.2(D-)
INA+: R11.2 U8.8(VIN+) U9.1
INA-: R11.1 U8.7(VIN-) U9.2
IP+: U18.1(IP+) U18.2(IP+) U20.2
IP-: U18.3(IP-) U18.4(IP-) U20.1
MISO: U1.16((PCINT4/MISO)PB4) U3.7(SO) U4.7(SO)
MOSI: U1.15((PCINT3/OC2A/MOSI)PB3) U27.4
NO1: RLY1.2 U10.3
NO2: RLY2.2 U10.1
NO3: RLY3.2 U13.3
NO4: RLY4.2 U13.1
NO5: RLY5.2 U14.3
NO6: RLY6.2 U14.1
RESET: C13.1 R7.1 SW2.2 U1.29(PC6(RESET#/PCINT14))
RX: H1.1 R1.1 U11.1(TXD)
SCK: R5.2 U1.17(PB5(SCK/PCINT5)) U3.5(SCK) U4.5(SCK)
SCL: R8.2 U1.28(PC5(ADC5/SCL/PCINT13)) U8.4(SCL) U23.4 U24.4
SDA: R9.1 U1.27(PC4(ADC4/SDA/PCINT12)) U8.3(SDA) U23.3 U24.3
SUPPLY: C3.1 C4.2 SW1.2 U6.1(VIN)
T1+: U2.2 U3.3(T+)
T2+: U4.3(T+) U5.2
TX: H2.1 R2.1 U11.5(RXD)
VOLTIN: F3.2 R21.2
VUSB: C14.2 C15.2 D9.2(A) F2.1
$1N6242: LEDTX1.2(-) R14.2
$1N6243: LEDRX1.2(-) R13.2
$1N6250: C13.2 U11.2(DTR#)
$1N6255: R13.1 U11.23(CBUS0)
$1N6256: R14.1 U11.22(CBUS1)
$1N6275: U1.7((PCINT6/XTAL1/TOSC1)PB6) Y1.1
$1N6282: U1.8((PCINT7/XTAL2/TOSC2)PB7) Y1.3
$1N6300: D4.2(A) LED4.2(K) Q2.3(D) RLY2.4
$1N6315: R2.2 U1.31(PD1(TXD/PCINT17))
$1N6316: R1.2 U1.30(PD0(RXD/PCINT16))
$1N6351: R10.1 U8.1(A1)
$1N6373: F3.1 U12.2
$1N6384: F4.2 U17.1
$1N6385: F5.2 U17.2
$1N6392: Q3.1(G) R25.2 R27.1
$1N6394: D5.2(A) LED5.2(K) Q3.3(D) RLY3.4
$1N6396: LED8.1(A) R35.1
$1N6399: D7.2(A) LED8.2(K) Q5.3(D) RLY5.4
$1N6400: Q5.1(G) R40.2 R42.1
$1N6403: LED5.1(A) R23.1
$1N6404: H2.2 R29.1 U16.4(DI)
$1N6416: Q1.1(G) R17.2 R19.1
$1N6419: D3.2(A) LED3.2(K) Q1.3(D) RLY1.4
$1N6422: H1.2 R32.1 U16.1(RO)
$1N6423: LED10.1(A) R39.1
$1N6434: F2.2 USB1.1(VBUS)
$1N6445: LED3.1(A) R15.1
$1N6460: D8.2(A) LED9.2(K) Q6.3(D) RLY6.4
$1N6462: LED9.1(A) R36.1
$1N6471: D6.2(A) LED6.2(K) Q4.3(D) RLY4.4
$1N6473: LED6.1(A) R24.1
$1N6474: LED4.1(A) R16.1
$1N6496: Q6.1(G) R41.2 R43.1
$1N6497: Q4.1(G) R26.2 R28.1
$1N6500: Q2.1(G) R18.2 R20.1
$1N6504: R12.1 U8.2(A0)
$1N6513: LED2.1(A) R5.1
$1N11240: D1.1(K) L1.1 U6.2(OUTPUT)
$1N15311: PR1.2 PR1.3 R4.2 U6.4(FB)
$1N15622: LED1.1(A) R3.1
$1N27340: F1.1 U7.2
$1N31380: LED7.1(A) R34.1
$1N38855: F1.2 SW1.1
$1N39161: C21.2 U18.6(FILTER)
$1N39391: LED11.1(A) R44.1

Not connected (* = marked no-connect by the designer): SCREW1 1*; SCREW2 1*; SCREW3 1*; SCREW4 1*; U3 8(N.C.)*; U4 8(N.C.)*; U11 3(RTS#)* 6(RI#)* 8(NC)* 9(DSR#)* 10(DCD#)* 11(CTS#)* 12(CBUS4)* 13(CBUS2)* 14(CBUS3)* 19(RESET#)* 24(NC)* 27(OSCI)* 28(OSCO)*; U23 5* 6*; U24 5* 6*; U25 4* 5*; U27 5* 6*; USB1 4(ID)*

## Notes on the sheet
- MICROCONTROLLER
- MAX6675
- STEPDOWN ADJ
- INA219
- USB TO TTL
- OUT 30A
- Default INA219 Address 0x40
- VOLT MAX 50V
- RS485 MODBUS TX
- LDO REGULATOR
- FUEL SENSOR & ACS
- RX-TX = RS485
  D2 = RPM INFRARED
  D3 = GAS LEVEL SERVO
  D4 = RE RS485
  D5 = DE RS485
  D6 = OUT 4
  D7 = OUT 5
  D8 = OUT 6
  D9 = CS1 MAX6675
  D10 = CS2 MAX6675
  A0 = OUT 1
  A1 = OUT 2
  A2 = OUT 3
  A3 = VOLT SENSOR
  A7 = FUEL SENSOR
  MISO-SCK = MAX6675
- GAS LEVEL SERVO + RPM PROXI
- LCD + MOUNTING HOLE
